# EAGLE design 0_3b (EAGLE 7.6.0)
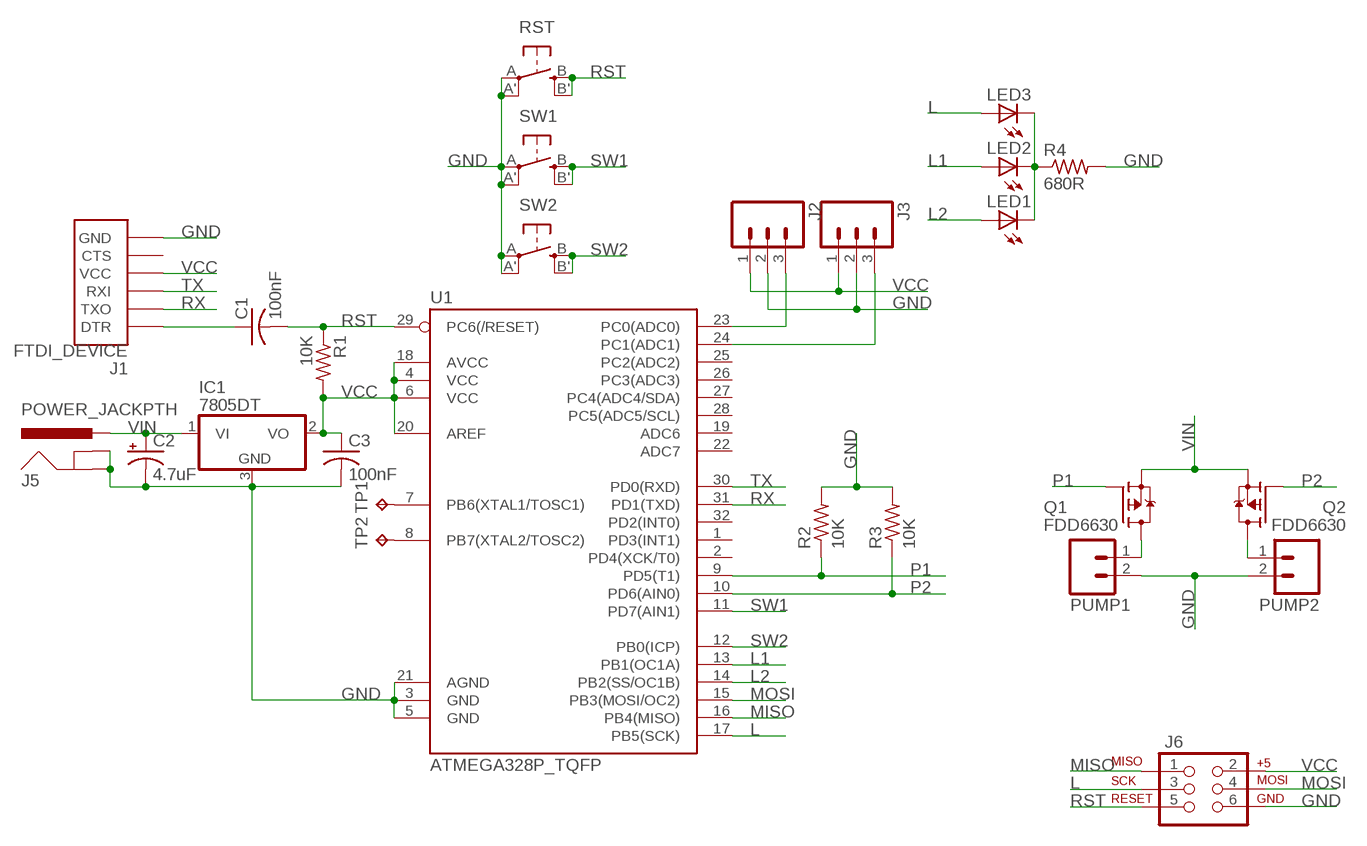
[diagram p0: schematic, sheet 1]

## Parts
C1  100nF  C-USC1206K  [C1206K]
C2  4.7uF  CPOL-US153CLV-0405  [153CLV-0405]
C3  100nF  C-USC1206K  [C1206K]
IC1  7805DT  [TO252]
J1  FTDI_DEVICE  [FTDI_DEVICE_SIDE]
J2  M03PTH  [1X03]
J3  M03PTH  [1X03]
J5  POWER_JACKPTH  [POWER_JACK_PTH]
J6  AVR_SPI_PRG_6PTH  [2X3]
LED1  LED3MM  [LED3MM]
LED2  LED3MM  [LED3MM]
LED3  LED3MM  [LED3MM]
PUMP1  M02PTH  [1X02]
PUMP2  M02PTH  [1X02]
Q1  FDD6630  FDD4141TO252  [TO252]
Q2  FDD6630  FDD4141TO252  [TO252]
R1  10K  R-US_M0805  [M0805]
R2  10K  R-US_M0805  [M0805]
R3  10K  R-US_M0805  [M0805]
R4  680R  R-US_M0805  [M0805]
RST  SPST_TACT-EVQQ2  [EVQ-Q2]
SW1  SPST_TACT-EVQQ2  [EVQ-Q2]
SW2  SPST_TACT-EVQQ2  [EVQ-Q2]
TP1  TPTP15SQ  [TP15SQ]
TP2  TPTP15SQ  [TP15SQ]
U1  ATMEGA328P_TQFP  [TQFP32-08]

## Nets
GND: C2.- C3.2 IC1.3(GND) J1.P$6(GND) J2.2 J3.2 J5.GND J5.GNDBREAK J6.6 PUMP1.2 PUMP2.2 R2.2 R3.2 R4.2 RST.A'(P1) RST.A(P) SW1.A'(P1) SW1.A(P) SW2.A'(P1) SW2.A(P) U1.3(GND) U1.5(GND) U1.21(AGND)
L: J6.3 LED3.A U1.17(PB5(SCK))
L1: LED2.A U1.13(PB1(OC1A))
L2: LED1.A U1.14(PB2(SS/OC1B))
MISO: J6.1 U1.16(PB4(MISO))
MOSI: J6.4 U1.15(PB3(MOSI/OC2))
N$1: LED1.K(C) LED2.K(C) LED3.K(C) R4.1
N$2: TP1.TP U1.7(PB6(XTAL1/TOSC1))
N$3: PUMP1.1 Q1.3(D)
N$4: C1.1 J1.P$1(DTR)
N$5: TP2.TP U1.8(PB7(XTAL2/TOSC2))
N$6: PUMP2.1 Q2.3(D)
N$9: J2.3 U1.23(PC0(ADC0))
N$10: J3.3 U1.24(PC1(ADC1))
P1: Q1.1(G) R2.1 U1.9(PD5(T1))
P2: Q2.1(G) R3.1 U1.10(PD6(AIN0))
RST: C1.2 J6.5 R1.1 RST.B'(S1) RST.B(S) U1.29(PC6(/RESET))
RX: J1.P$2(TXO) U1.31(PD1(TXD))
SW1: SW1.B'(S1) SW1.B(S) U1.11(PD7(AIN1))
SW2: SW2.B'(S1) SW2.B(S) U1.12(PB0(ICP))
TX: J1.P$3(RXI) U1.30(PD0(RXD))
VCC: C3.1 IC1.2(VO) J1.P$4(VCC) J2.1 J3.1 J6.2 R1.2 U1.4(VCC) U1.6(VCC) U1.18(AVCC) U1.20(AREF)
VIN: C2.+ IC1.1(VI) J5.PWR Q1.2(S) Q2.2(S)
Unconnected: J1.P$5(CTS) U1.1(PD3(INT1)) U1.2(PD4(XCK/T0)) U1.19(ADC6) U1.22(ADC7) U1.25(PC2(ADC2)) U1.26(PC3(ADC3)) U1.27(PC4(ADC4/SDA)) U1.28(PC5(ADC5/SCL)) U1.32(PD2(INT0))

## Library data of the parts
C1 = resistor:C-US: CAPACITOR, American symbol
C2 = rcl:CPOL-US: POLARIZED CAPACITOR, American symbol
C3 = rcl:C-US: CAPACITOR, American symbol
IC1 = linear:78*: Positive VOLTAGE REGULATOR Source: http://cache.national.com/ds/LM/LM78L05.pdf http://www.fairchildsemi.com/ds/LM/LM7805.pdf
J1 = SparkFun-Connectors:FTDI_DEVICE: Connector which mates to FTDI basic or FTDI cable.
J2 J3 = SparkFun-Connectors:M03: Header 3 Standard 3-pin 0.1" header. Use with straight break away headers (SKU : PRT-00116), right angle break away headers (PRT-00553), swiss pins (PRT-00743), machine pins (PRT-00117), and female headers (PRT-00115). Molex polarized connector foot print use with SKU : PRT-08232 with associated crimp pins and housings.
J5 = SparkFun-Connectors:POWER_JACK: Power Jack This is the standard 5.5mm barrel jack for power. The PTH is the most common, proven, reliable, footprint. The Slot footprint only works if the mill layer is transmitted to the PCB fab house so be warned. Mating wall wart : TOL-00298 (and others); PROD_ID: CONN-08197
J6 = SparkFun-Connectors:AVR_SPI_PRG_6: AVR ISP 6 Pin This is the reduced ISP connector for AVR programming. Common on Arduino. This footprint will take up less PCB space and can be used with a 10-pin to 6-pin adapter such as SKU: BOB-08508 **Special note about "TEST_POINT" package. The stop mask is on the top side, so if you want your programming test points to be on the bottom of your board, make sure to place this package on the bottom side of the board. This also ensure that the orientation to program from the bottom side will be correct.
LED1-LED3 = led:LED: LED OSRAM: - CHIPLED LG R971, LG N971, LY N971, LG Q971, LY Q971, LO R971, LY R971 LH N974, LH R974 LS Q976, LO Q976, LY Q976 LO Q996 - Hyper CHIPLED LW Q18S LB Q993, LB Q99A, LB R99A - SideLED LS A670, LO A670, LY A670, LG A670, LP A670 LB A673, LV A673, LT A673, LW A673 LH A674 LY A675 LS A676, LA A676, LO A676, LY A676, LW A676 LS A679, LY A679, LG A679 - Hyper Micro SIDELED® LS Y876, LA Y876, LO Y876, LY Y876 LT Y87S - SmartLED LW L88C, LW L88S LB L89C, LB L89S, LG L890 LS L89K, LO L89K, LY L89K LS L896, LA L896, LO L896, LY L896 - TOPLED LS T670, LO T670, LY T670, LG T670, LP T670 LSG T670, LSP T670, LSY T670, LOP T670, LYG T670 LG T671, LOG T671, LSG T671 LB T673, LV T673, LT T673, LW T673 LH T674 LS T676, LA T676, LO T676, LY T676, LB T676, LH T676, LSB T676, LW T676 LB T67C, LV T67C, LT T67C, LS T67K, LO T67K, LY T67K, LW E67C LS E67B, LA E67B, LO E67B, LY E67B, LB E67C, LV E67C, LT E67C LW T67C LS T679, LY T679, LG T679 LS T770, LO T770, LY T770, LG T770, LP T770 LB T773, LV T773, LT T773, LW T773 LH T774 LS E675, LA E675, LY E675, LS T675 LS T776, LA T776, LO T776, LY T776, LB T776 LHGB T686 LT T68C, LB T68C - Hyper Mini TOPLED® LB M676 - Mini TOPLED Santana® LG M470 LS M47K, LO M47K, LY M47K Source: http://www.osram.convergy.de LUXEON: - LUMILED® LXK2-PW12-R00, LXK2-PW12-S00, LXK2-PW14-U00, LXK2-PW14-V00 LXK2-PM12-R00, LXK2-PM12-S00, LXK2-PM14-U00 LXK2-PE12-Q00, LXK2-PE12-R00, LXK2-PE12-S00, LXK2-PE14-T00, LXK2-PE14-U00 LXK2-PB12-K00, LXK2-PB12-L00, LXK2-PB12-M00, LXK2-PB14-N00, LXK2-PB14-P00, LXK2-PB14-Q00 LXK2-PR12-L00, LXK2-PR12-M00, LXK2-PR14-Q00, LXK2-PR14-R00 LXK2-PD12-Q00, LXK2-PD12-R00, LXK2-PD12-S00 LXK2-PH12-R00, LXK2-PH12-S00 LXK2-PL12-P00, LXK2-PL12-Q00, LXK2-PL12-R00 Source: www.luxeon.com KINGBRIGHT: KA-3528ASYC Source: www.kingbright.com
PUMP1 PUMP2 = SparkFun-Connectors:M02: Standard 2-pin 0.1" header. Use with - straight break away headers ( PRT-00116) - right angle break away headers (PRT-00553) - swiss pins (PRT-00743) - machine pins (PRT-00117) - female headers (PRT-00115) Molex polarized connector foot print use with: PRT-08233 with associated crimp pins and housings. 2.54_SCREWTERM for use with PRT-10571. 3.5mm Screw Terminal footprints for PRT-08084 5mm Screw Terminal footprints for use with PRT-08432
Q1 Q2 = transistor-fet:FDD4141: P-Channel PowerTrench® MOSFET Source: FDD4141.pdf
R1-R4 = resistor:R-US_: RESISTOR, American symbol
RST SW1 SW2 = adafruit:SPST_TACT: SMT 6mm switch, EVQQ2 series http://www.ladyada.net/library/eagle
TP1 TP2 = testpad:TP: Test pad
U1 = SparkFun-DigitalIC:ATMEGA328P_TQFP; PROD_ID: IC-09069

## Board
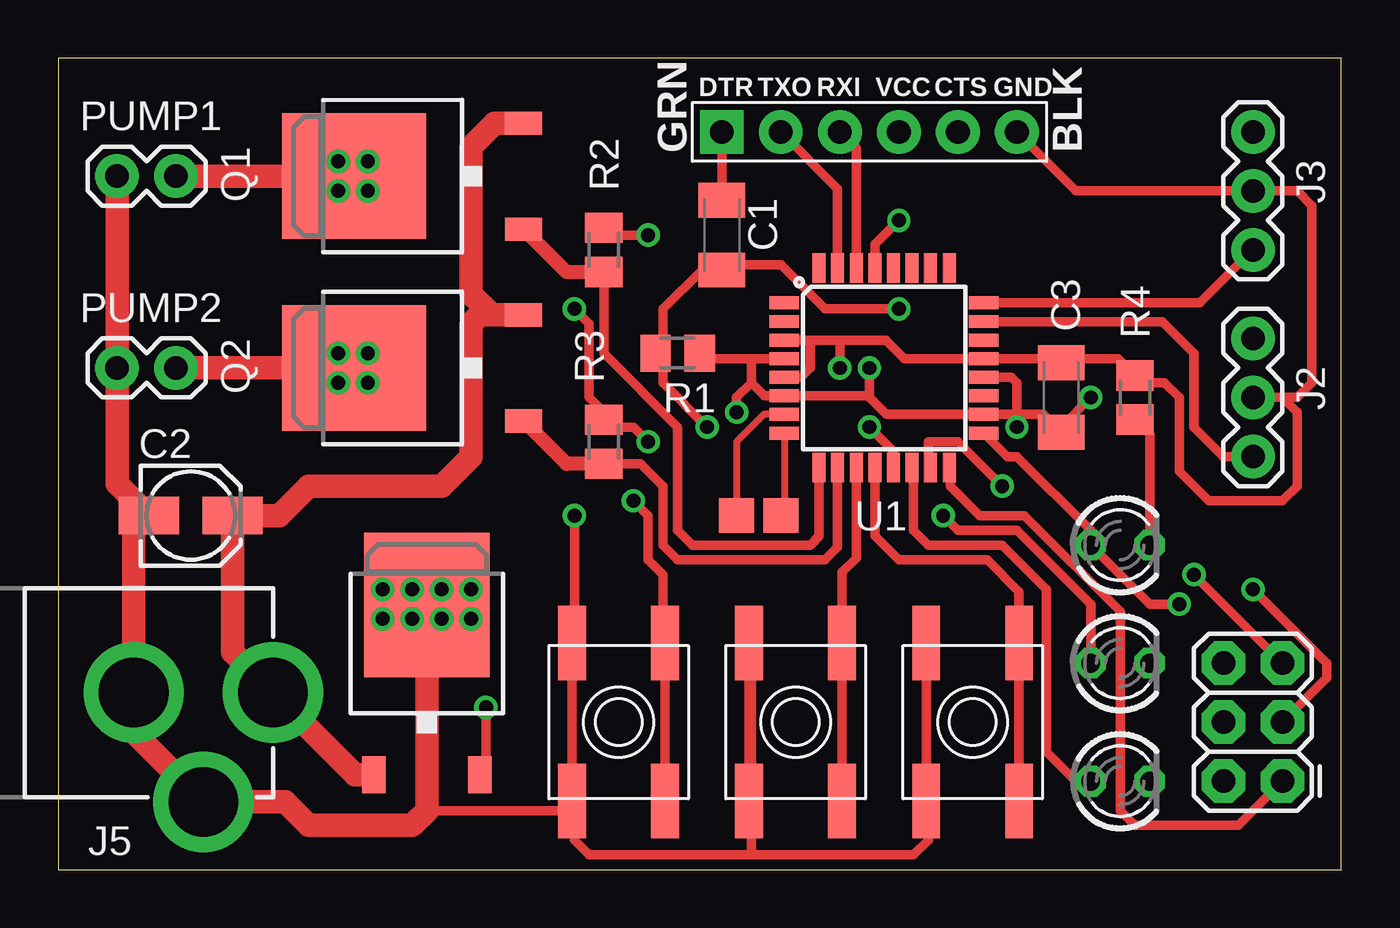
[diagram p1: board, top side]
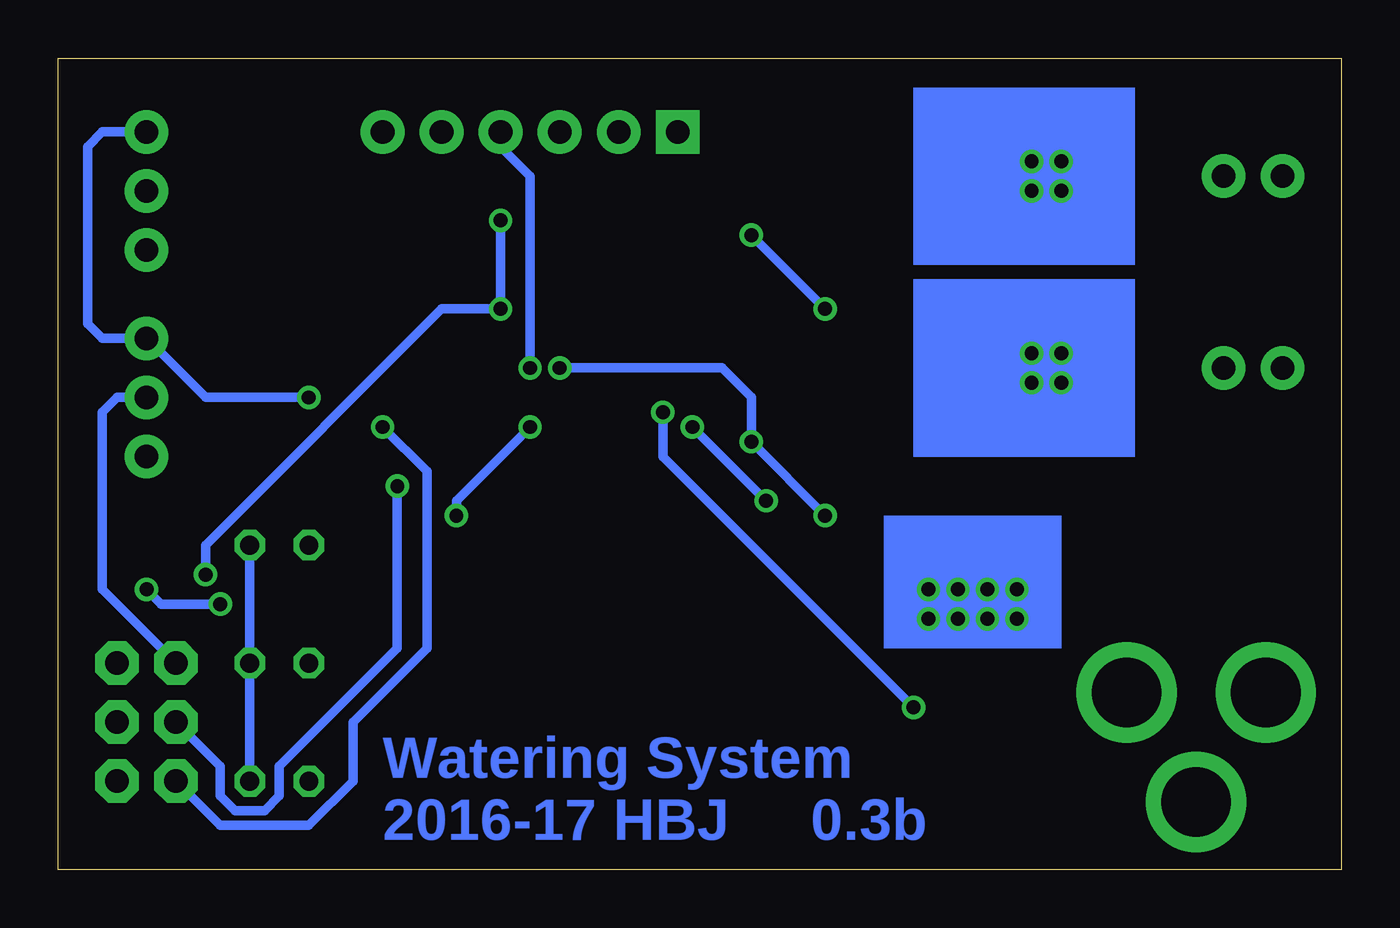
[diagram p2: board, bottom side, seen from below]

Size 55.24 x 34.92 mm. Coordinates in mm from the lower left corner, seen from the top.
Outline: 0,34.91 0,0 55.24,0 55.24,34.92 0,34.92
Copper layers (1*16): Top 0.035mm / dielectric 1.5mm / Bottom 0.035mm
Design rules "default": minimum track width 10mil, minimum drill 24mil, track to track 8mil, track to pad 8mil, pad to pad 8mil, via to via 8mil, smd to smd 8mil, copper to edge 40mil, drill to drill 8mil, minimum pad ring 10mil, minimum via ring 8mil, stop-mask expansion 4mil, vias tented up to drill 0mil, thermal gap 10mil

### Footprints (pad centres in the part's own frame; a part is rotated, then mirrored left to right if it is on the bottom)
C1206K = smd 1.5 x 2: 1 -1.5,0; 2 1.5,0
153CLV-0405 = smd 2.6 x 1.6: + 1.8,0; - -1.8,0
TO252 = smd 1 x 1.6: 1 -2.28,-4.8; 2 2.28,-4.8 | smd 5.4 x 6.2: 3 0,2.5
FTDI_DEVICE_SIDE = drill 1.016 pad 1.88 square: P$1 -6.35,0 | drill 1.016 pad 1.88: P$2 -3.81,0; P$3 -1.27,0; P$4 1.27,0; P$5 3.81,0; P$6 6.35,0
1X03 = drill 1.016 pad 1.88: 1 0,0; 2 2.54,0; 3 5.08,0
POWER_JACK_PTH = drill 2.997 pad 4.318: GND 0,7.7; GNDBREAK 4.7,10.7; PWR 0,13.7
2X3 = drill 1.016 pad 1.88 octagon: 1 0,0; 2 0,2.54; 3 2.54,0; 4 2.54,2.54; 5 5.08,0; 6 5.08,2.54
LED3MM = drill 0.813 octagon: A -1.27,0; K 1.27,0
1X02 = drill 1.016 pad 1.88: 1 0,0; 2 2.54,0
M0805 = smd 1.3 x 1.6: 1 -0.95,0; 2 0.95,0
EVQ-Q2 = smd 3.2 x 1.2: A -3.4,-2; A' 3.4,-2; B -3.4,2; B' 3.4,2
TP15SQ = smd 1.5 x 1.5: TP 0,0
TQFP32-08 = smd 1.27 x 0.559: 1 -4.293,2.8; 2 -4.293,2; 3 -4.293,1.2; 4 -4.293,0.4; 5 -4.293,-0.4; 6 -4.293,-1.2; 7 -4.293,-2; 8 -4.293,-2.8; 17 4.293,-2.8; 18 4.293,-2; 19 4.293,-1.2; 20 4.293,-0.4; 21 4.293,0.4; 22 4.293,1.2; 23 4.293,2; 24 4.293,2.8 | smd 0.559 x 1.27: 9 -2.8,-4.293; 10 -2,-4.293; 11 -1.2,-4.293; 12 -0.4,-4.293; 13 0.4,-4.293; 14 1.2,-4.293; 15 2,-4.293; 16 2.8,-4.293; 25 2.8,4.293; 26 2,4.293; 27 1.2,4.293; 28 0.4,4.293; 29 -0.4,4.293; 30 -1.2,4.293; 31 -2,4.293; 32 -2.8,4.293

### Placement (x,y rotation side)
C1  28.58,27.3 270 top
C2  5.71,15.24 0 top
C3  43.18,20.32 90 top
IC1  15.88,8.89 0 top
J1  34.92,31.75 0 top
J2  51.44,22.86 270 top
J3  51.44,31.75 270 top
J5  -4.44,7.62 270 top
J6  52.71,3.81 90 top
LED1  45.72,3.81 0 top
LED2  45.72,8.89 0 top
LED3  45.72,13.97 0 top
PUMP1  5.08,29.84 180 top
PUMP2  5.08,21.59 180 top
Q1  15.24,29.84 90 top
Q2  15.24,21.59 90 top
R1  26.67,22.23 0 top
R2  23.49,26.67 90 top
R3  23.49,18.41 90 top
R4  46.35,20.32 90 top
RST  24.13,6.35 270 top
SW1  31.75,6.35 270 top
SW2  39.37,6.35 270 top
TP1  29.21,15.24 0 top
TP2  31.12,15.24 0 top
U1  35.56,21.59 0 top

### Tracks (layer width: path | path; a pad name or v marks a point on that pad's centre or on a via)
GND  (via drill 0.6)
  Top 0.406: U1.21 43.01,21.99 C3.2 | U1.3 32.38,22.79 | 32.38,22.79 33.66,22.79 | 33.66,22.79 35.63,22.79 36.43,21.99 U1.21 | SW1.A' SW1.A 29.84,9.75 29.84,0.63 | SW2.A SW2.A' 37.47,2.86 37.47,1.27 36.83,0.63 29.84,0.63 | RST.A RST.A' 21.72,2.54 15.88,2.54 | RST.A 22.13,3.27 22.23,3.17 22.23,1.27 22.86,0.63 29.84,0.63 | U1.21 45.63,21.99 R4.2 46.67,20.95 47.62,20.95 48.26,20.32 48.26,17.14 49.53,15.88 52.71,15.88 53.34,16.51 53.34,19.69 52.71,20.32 J2.2 53.34,20.32 53.98,20.95 53.98,28.57 53.34,29.21 J3.2 43.81,29.21 J1.P$6 | U1.5 31.98,21.19 32.38,21.59 32.38,22.79 | v25.4,27.3 23.49,27.3 R2.2 | v22.23,24.13 22.86,23.49 22.86,20.32 23.49,19.69 R3.2 23.49,19.05 24.77,19.05 v25.4,18.41 | v22.23,15.24 22.23,10.16 RST.A | v33.66,21.59 33.66,22.79
  Top 1.016: PUMP1.2 PUMP2.2 2.54,16.62 C2.- 3.26,14.58 J5.GND 3.26,5.92 J5.GNDBREAK 9.78,2.92 10.8,1.9 15.24,1.9 15.88,2.54 IC1.3
  Bottom 0.406: J2.2 52.71,20.32 53.34,19.69 53.34,12.06 J6.6 | v22.23,24.13 v25.4,27.3 | v22.23,15.24 v25.4,18.41 25.4,20.32 26.67,21.59 v33.66,21.59
L  (via drill 0.6)
  Top 0.406: v48.26,11.43 46.99,11.43 LED3.A 44.45,14.6 41.27,17.78 40.86,17.78 U1.17 | v51.44,12.06 54.61,8.89 54.61,8.25 J6.3
  Bottom 0.406: v48.26,11.43 50.8,11.43 v51.44,12.06
L1  (via drill 0.6)
  Top 0.406: LED2.A 44.45,11.43 41.27,14.6 38.73,14.6 v38.1,15.24 | v34.92,19.05 35.96,18.02 U1.13
  Bottom 0.406: v38.1,15.24 38.1,15.88 v34.92,19.05
L2
  Top 0.406: LED1.A 43.81,3.81 42.55,5.08 42.55,12.06 40.64,13.97 37.47,13.97 36.83,14.6 36.83,17.23 U1.14
MISO
  Top 0.406: J6.1 50.8,1.9 46.35,1.9 45.72,2.54 45.72,11.11 41.59,15.24 39.69,15.24 38.42,16.51 38.42,17.24 U1.16
MOSI  (via drill 0.6)
  Top 0.406: v40.64,16.51 38.73,18.41 37.47,18.41 37.47,17.78 U1.15
  Bottom 0.406: v40.64,16.51 40.64,9.52 45.72,4.45 45.72,3.17 46.35,2.54 47.62,2.54 48.26,3.17 48.26,4.45 J6.4
N$1
  Top 0.406: LED3.K 46.99,18.73 R4.1
  Bottom 0.406: LED1.K LED2.K LED3.K
N$2
  Top 0.305: U1.7 30.38,19.59 29.21,18.41 TP1.TP
N$3
  Top 1.016: PUMP1.1 Q1.3
N$4
  Top 0.406: C1.1 J1.P$1
N$5
  Top 0.305: U1.8 31.27,15.39 TP2.TP
N$6
  Top 1.016: PUMP2.1 Q2.3
N$7  (via drill 0.6)
  other vias: 12.07,29.21
N$8  (via drill 0.6)
  other vias: 12.07,30.48
N$9
  Top 0.406: J2.3 50.16,17.78 48.9,19.05 48.9,22.23 47.53,23.59 U1.23
N$10
  Top 0.406: U1.24 49.16,24.39 J3.3
N$11  (via drill 0.6)
  other vias: 13.34,30.48
N$12  (via drill 0.6)
  other vias: 13.34,29.21
N$13  (via drill 0.6)
  other vias: 12.07,22.23
N$14  (via drill 0.6)
  other vias: 13.34,22.23
N$15  (via drill 0.6)
  other vias: 13.34,20.95
N$16  (via drill 0.6)
  other vias: 12.07,20.95
N$17  (via drill 0.6)
  other vias: 15.24,12.06
N$18  (via drill 0.6)
  other vias: 16.51,12.06
N$19  (via drill 0.6)
  other vias: 16.51,10.79
N$20  (via drill 0.6)
  other vias: 15.24,10.79
N$21  (via drill 0.6)
  other vias: 13.97,10.79
N$22  (via drill 0.6)
  other vias: 13.97,12.06
N$23  (via drill 0.6)
  other vias: 17.78,12.06
N$24  (via drill 0.6)
  other vias: 17.78,10.79
P1
  Top 0.406: U1.9 32.76,14.34 32.38,13.97 27.3,13.97 26.67,14.6 26.67,19.05 23.49,22.23 R2.1
  Top 0.61: R2.1 21.88,25.72 Q1.1
P2
  Top 0.406: U1.10 33.56,13.88 33.02,13.33 26.67,13.33 26.04,13.97 26.04,16.51 25.08,17.46 R3.1
  Top 0.61: R3.1 21.88,17.46 Q2.1
RST  (via drill 0.6)
  Top 0.406: RST.B' RST.B 26.04,10.16 26.04,12.7 25.4,13.33 25.4,15.24 v24.77,15.88 | v27.94,19.05 26.04,20.95 26.04,22.23 R1.1 26.04,22.54 26.04,24.13 27.71,25.8 C1.2 28.58,26.03 31.12,26.03 33.02,24.13 v36.2,24.13 | v36.2,27.94 35.16,26.91 U1.29 | v48.9,12.7 J6.5
  Bottom 0.406: v24.77,15.88 v27.94,19.05 | v36.2,27.94 v36.2,24.13 38.73,24.13 48.9,13.97 v48.9,12.7
RX
  Top 0.406: U1.31 33.56,29.3 J1.P$2
SW1
  Top 0.406: U1.11 34.36,13.4 33.75,12.79 SW1.B SW1.B'
SW2
  Top 0.406: U1.12 35.16,14.37 36.2,13.33 40.01,13.33 41.37,11.97 SW2.B SW2.B'
TX
  Top 0.406: U1.30 34.36,31.05 J1.P$3
VCC  (via drill 0.6)
  Top 0.406: 41.18,19.59 42.41,19.59 C3.1 43.18,19.05 v44.45,20.32 | 41.18,19.59 U1.18 35.66,19.59 34.92,20.32 | 41.27,19.69 41.27,20.95 41.04,21.19 U1.20 | v34.92,21.59 34.92,20.32 | 34.92,20.32 34.85,20.39 U1.6 30.41,20.39 29.84,20.95 | U1.4 29.84,21.99 | 29.84,21.99 27.85,21.99 R1.2 | 29.84,20.95 29.84,21.99 | v18.41,6.98 18.41,4.45 IC1.2 | v29.21,19.69 29.21,20.32 29.84,20.95 | v41.27,19.05 41.27,19.69 | 41.27,19.69 41.18,19.59
  Bottom 0.406: J3.1 53.34,31.75 53.98,31.12 53.98,23.49 53.34,22.86 J2.1 48.9,20.32 v44.45,20.32 | v34.92,21.59 34.92,29.84 36.2,31.12 J1.P$4 | v18.41,6.98 29.21,17.78 v29.21,19.69 | v41.27,19.05 39.37,17.14 39.37,9.52 42.55,6.35 42.55,3.81 44.45,1.9 48.26,1.9 J6.2
VIN
  Top 1.016: IC1.1 12.79,4.09 J5.PWR 7.52,9.36 C2.+ 9.52,15.24 10.8,16.51 16.51,16.51 17.78,17.78 17.78,23.49 18.16,23.87 Q2.2 18.68,23.87 17.78,24.77 17.78,31.12 18.79,32.12 Q1.2
(copper drawn outside any net)
  shapes: Bottom area x4

### Text on the board
Bottom: 0.3b | Watering System / 2016-17 HBJ
bStop: 0.3b | Watering System / 2016-17 HBJ